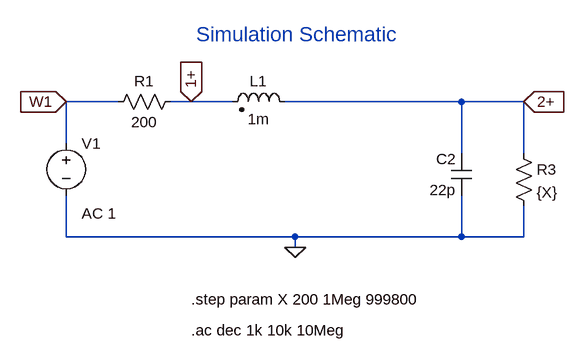
[diagram p0: schematic simulation_schematic_ltspice.asc]
simulation_schematic_ltspice.asc, the LTspice schematic file:
Version 4
SHEET 1 880 680
WIRE 48 96 -32 96
WIRE 160 96 128 96
WIRE 224 96 160 96
WIRE 576 96 304 96
WIRE 672 96 576 96
WIRE -32 160 -32 96
WIRE 576 176 576 96
WIRE 672 176 672 96
WIRE -32 304 -32 240
WIRE 320 304 -32 304
WIRE 576 304 576 240
WIRE 576 304 320 304
WIRE 672 304 672 256
WIRE 672 304 576 304
WIRE 320 320 320 304
FLAG 320 320 0
FLAG 672 96 2+
IOPIN 672 96 In
FLAG 160 96 1+
IOPIN 160 96 In
FLAG -32 96 W1
IOPIN -32 96 In
SYMBOL voltage -32 144 R0
WINDOW 123 24 124 Left 2
WINDOW 39 0 0 Left 0
SYMATTR Value2 AC 1
SYMATTR InstName V1
SYMATTR Value ""
SYMBOL res 144 80 R90
WINDOW 0 0 56 VBottom 2
WINDOW 3 32 56 VTop 2
SYMATTR InstName R1
SYMATTR Value 200
SYMBOL ind2 320 112 M270
WINDOW 0 32 56 VTop 2
WINDOW 3 5 56 VBottom 2
SYMATTR InstName L1
SYMATTR Value 1m
SYMATTR Type ind
SYMATTR SpiceLine Rser=100m Cpar=15p
SYMBOL res 656 160 R0
SYMATTR InstName R3
SYMATTR Value {X}
SYMBOL cap 592 240 R180
WINDOW 0 24 56 Left 2
WINDOW 3 24 8 Left 2
SYMATTR InstName C2
SYMATTR Value 22p
TEXT 168 -8 Left 3 ;Simulation Schematic
TEXT 160 400 Left 2 !.step param X 200 1Meg 999800
TEXT 160 448 Left 2 !.ac dec 1k 10k 10Meg

The netlist it stands for:
* simulation_schematic_ltspice.asc
V1 W1 0 AC 1
R1 1+ W1 200
L1 2+ 1+ 1m Rser=100m Cpar=15p
R3 2+ 0 {X}
C2 0 2+ 22p
* Simulation Schematic
.step param X 200 1Meg 999800
.ac dec 1k 10k 10Meg
.backanno
.end